# Altium schematic sheet Sheet2.SchDoc
size A; SheetNumber: 2; SheetTotal: 2
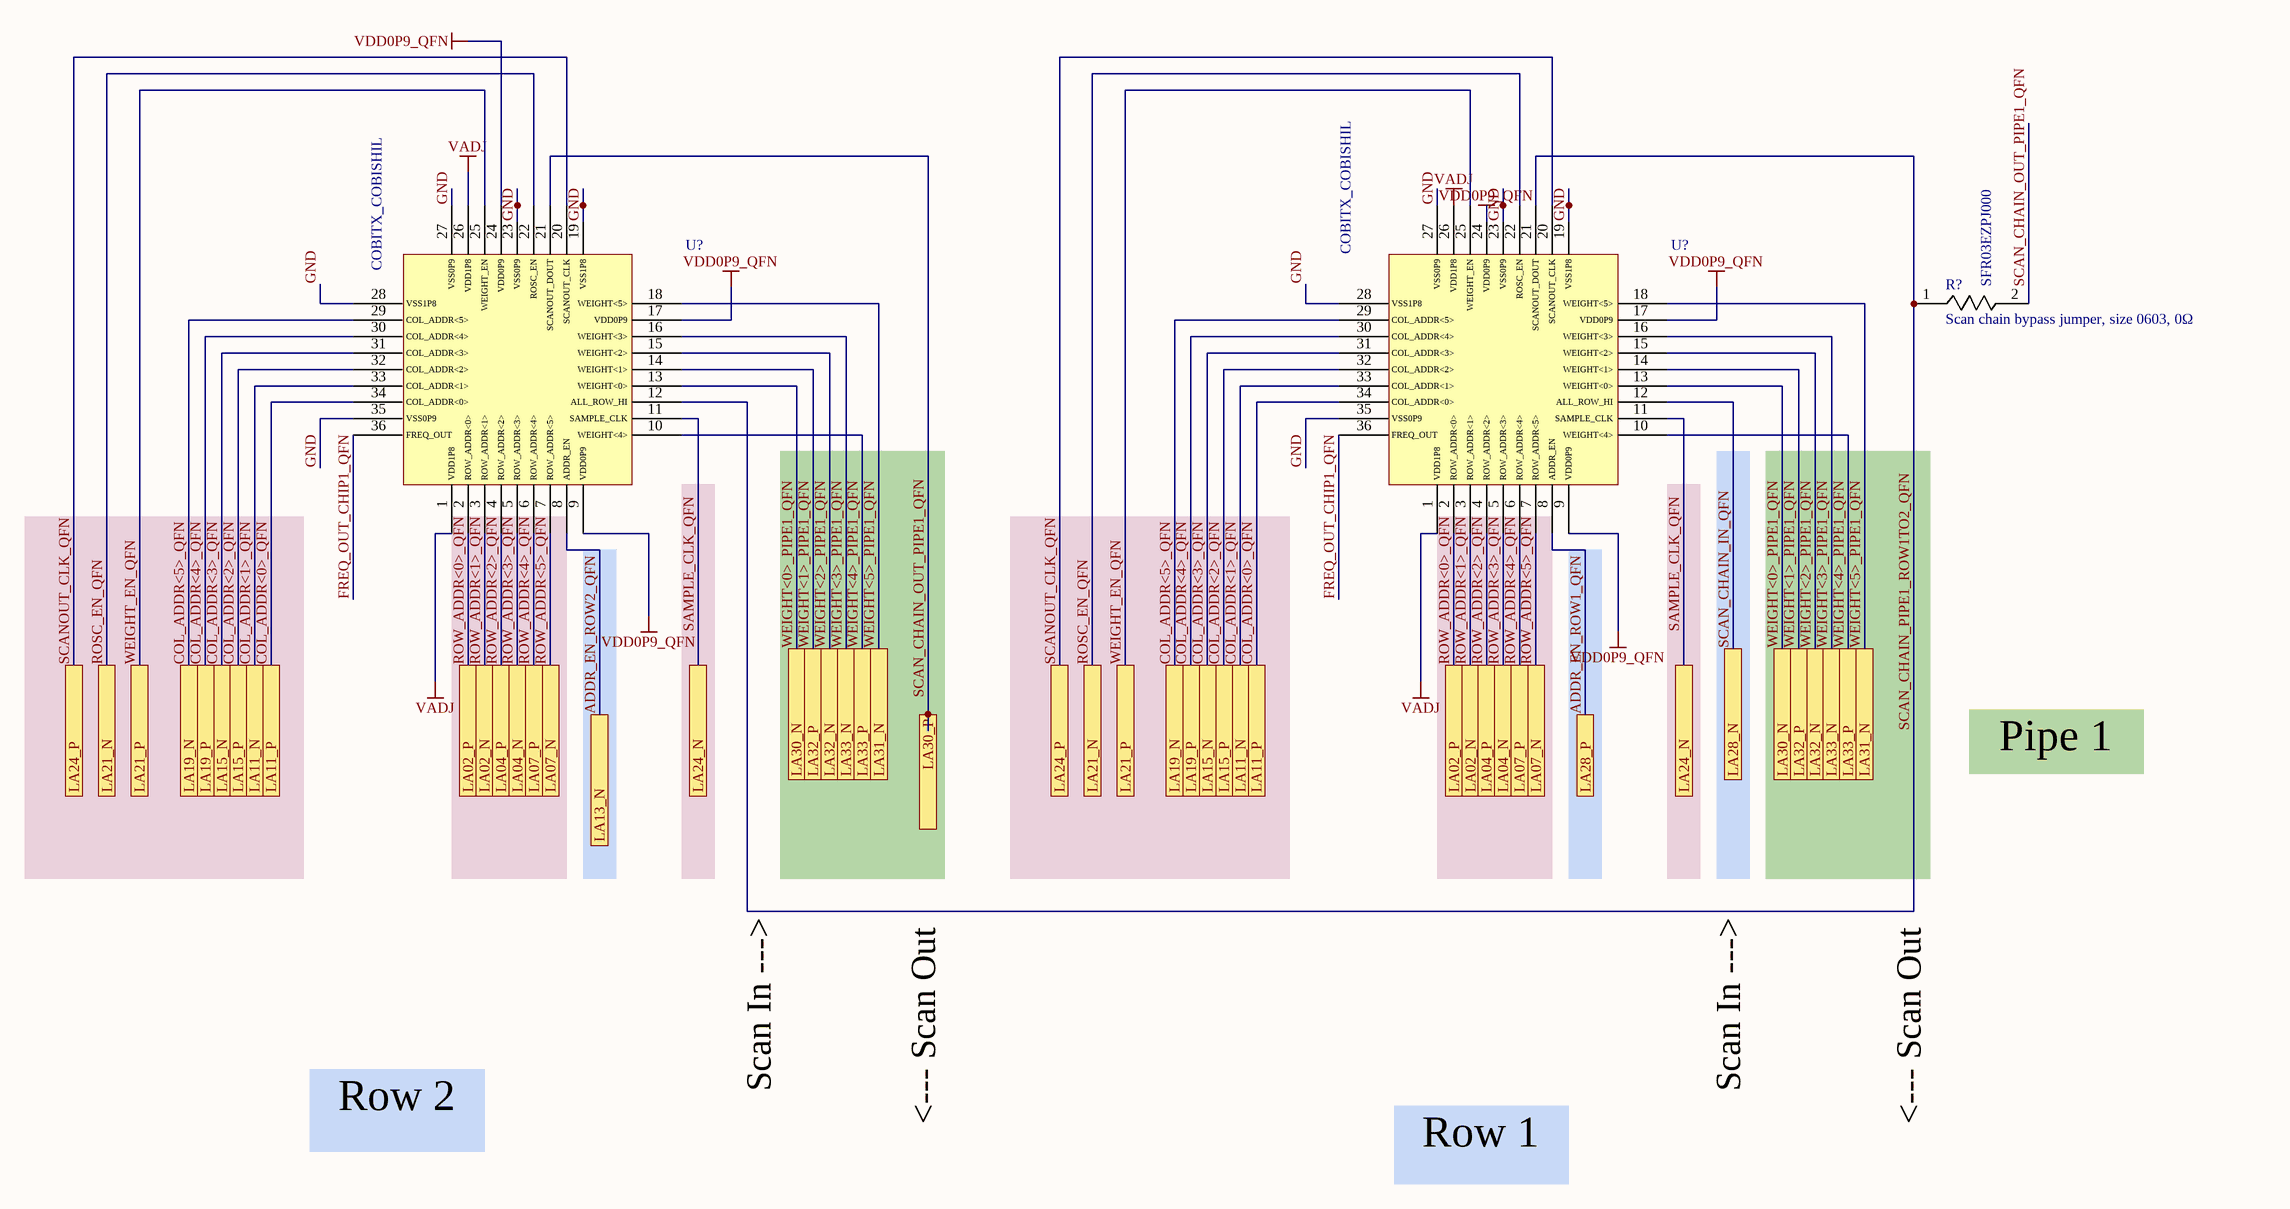
[diagram p0: Sheet2.SchDoc]

## Parts
(Parts that share a designator on the sheet are numbered #1, #2 ... from top to bottom, then left to right.)
R?  Scan chain bypass jumper, size 0603, 0Ω  [RESC1608X55N]
U?#1  COBITX_COBISHIL  [QFN-36 w/o solder mask]
U?#2  COBITX_COBISHIL  [QFN-36 w/o solder mask]

## Ports
LA02_N, LA02_P, LA04_N, LA04_P, LA07_N, LA07_P, LA11_N, LA11_P, LA13_N, LA15_N, LA15_P, LA19_N, LA19_P, LA21_N, LA21_P, LA24_N, LA24_P, LA28_N, LA28_P, LA30_N, LA30_P, LA31_N, LA32_N, LA32_P, LA33_N, LA33_P

## Nets
VADJ: U?#1.1(VDD1P8) U?#1.26(VDD1P8) U?#2.1(VDD1P8) U?#2.26(VDD1P8)
VDD0P9_QFN: U?#1.9(VDD0P9) U?#1.17(VDD0P9) U?#1.24(VDD0P9) U?#2.9(VDD0P9) U?#2.17(VDD0P9) U?#2.24(VDD0P9)
ADDR_EN_ROW1_QFN: U?#2.8(ADDR_EN) ; port LA28_P
ADDR_EN_ROW2_QFN: U?#1.8(ADDR_EN) ; port LA13_N
COL_ADDR<0>_QFN: U?#1.34(COL_ADDR<0>) U?#2.34(COL_ADDR<0>) ; port LA11_P
COL_ADDR<1>_QFN: U?#1.33(COL_ADDR<1>) U?#2.33(COL_ADDR<1>) ; port LA11_N
COL_ADDR<2>_QFN: U?#1.32(COL_ADDR<2>) U?#2.32(COL_ADDR<2>) ; port LA15_P
COL_ADDR<3>_QFN: U?#1.31(COL_ADDR<3>) U?#2.31(COL_ADDR<3>) ; port LA15_N
COL_ADDR<4>_QFN: U?#1.30(COL_ADDR<4>) U?#2.30(COL_ADDR<4>) ; port LA19_P
COL_ADDR<5>_QFN: U?#1.29(COL_ADDR<5>) U?#2.29(COL_ADDR<5>) ; port LA19_N
FREQ_OUT_CHIP1_QFN: U?#1.36(FREQ_OUT) U?#2.36(FREQ_OUT)
GND: U?#1.19(VSS1P8) U?#1.23(VSS0P9) U?#1.27(VSS0P9) U?#1.28(VSS1P8) U?#1.35(VSS0P9) U?#2.19(VSS1P8) U?#2.23(VSS0P9) U?#2.27(VSS0P9) U?#2.28(VSS1P8) U?#2.35(VSS0P9)
ROSC_EN_QFN: U?#1.22(ROSC_EN) U?#2.22(ROSC_EN) ; port LA21_N
ROW_ADDR<0>_QFN: U?#1.2(ROW_ADDR<0>) U?#2.2(ROW_ADDR<0>) ; port LA02_P
ROW_ADDR<1>_QFN: U?#1.3(ROW_ADDR<1>) U?#2.3(ROW_ADDR<1>) ; port LA02_N
ROW_ADDR<2>_QFN: U?#1.4(ROW_ADDR<2>) U?#2.4(ROW_ADDR<2>) ; port LA04_P
ROW_ADDR<3>_QFN: U?#1.5(ROW_ADDR<3>) U?#2.5(ROW_ADDR<3>) ; port LA04_N
ROW_ADDR<4>_QFN: U?#1.6(ROW_ADDR<4>) U?#2.6(ROW_ADDR<4>) ; port LA07_P
ROW_ADDR<5>_QFN: U?#1.7(ROW_ADDR<5>) U?#2.7(ROW_ADDR<5>) ; port LA07_N
SAMPLE_CLK_QFN: U?#1.11(SAMPLE_CLK) U?#2.11(SAMPLE_CLK) ; port LA24_N
SCAN_CHAIN_IN_QFN: U?#2.12(ALL_ROW_HI) ; port LA28_N
SCAN_CHAIN_OUT_PIPE1_QFN: R?.2 U?#1.21(SCANOUT_DOUT) ; port LA30_P
SCAN_CHAIN_PIPE1_ROW1TO2_QFN: R?.1 U?#1.12(ALL_ROW_HI) U?#2.21(SCANOUT_DOUT)
SCANOUT_CLK_QFN: U?#1.20(SCANOUT_CLK) U?#2.20(SCANOUT_CLK) ; port LA24_P
WEIGHT<0>_PIPE1_QFN: U?#1.13(WEIGHT<0>) U?#2.13(WEIGHT<0>) ; port LA30_N
WEIGHT<1>_PIPE1_QFN: U?#1.14(WEIGHT<1>) U?#2.14(WEIGHT<1>) ; port LA32_P
WEIGHT<2>_PIPE1_QFN: U?#1.15(WEIGHT<2>) U?#2.15(WEIGHT<2>) ; port LA32_N
WEIGHT<3>_PIPE1_QFN: U?#1.16(WEIGHT<3>) U?#2.16(WEIGHT<3>) ; port LA33_N
WEIGHT<4>_PIPE1_QFN: U?#1.10(WEIGHT<4>) U?#2.10(WEIGHT<4>) ; port LA33_P
WEIGHT<5>_PIPE1_QFN: U?#1.18(WEIGHT<5>) U?#2.18(WEIGHT<5>) ; port LA31_N
WEIGHT_EN_QFN: U?#1.25(WEIGHT_EN) U?#2.25(WEIGHT_EN) ; port LA21_P

## Notes on the sheet
- (near R?) SFR03EZPJ000
- Pipe 1
- Scan In --->
- Row 2
- <--- Scan Out
- Row 1

## Library data of the parts
R? = 0603WAF1003T5E: Resistor; Manufacturer_Name: UNI-ROYAL(Uniroyal Elec); Datasheet Link: https://datasheet.lcsc.com/szlcsc/Uniroyal-Elec-0603WAF1003T5E_C25803.pdf; Height: 0.55mm; Manufacturer_Part_Number: 0603WAF1003T5E; Supplier 1: Digi-Key
U?#1 U?#2 = COBITX_COBISHIL: QFN-36